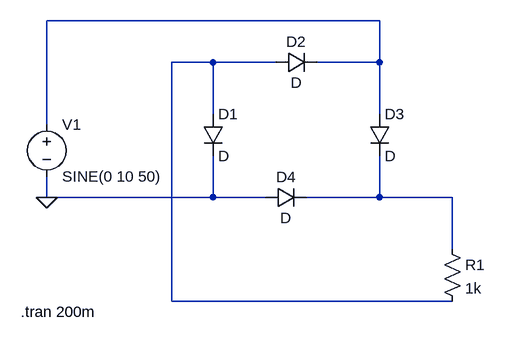
[diagram p0: schematic wave_rectifier.asc]
wave_rectifier.asc, the LTspice schematic file:
Version 4.1
SHEET 1 880 680
WIRE 592 -64 80 -64
WIRE 336 0 272 0
WIRE 432 0 336 0
WIRE 592 0 592 -64
WIRE 592 0 496 0
WIRE 336 80 336 0
WIRE 592 80 592 0
WIRE 80 96 80 -64
WIRE 80 208 80 176
WIRE 336 208 336 144
WIRE 336 208 80 208
WIRE 416 208 336 208
WIRE 592 208 592 144
WIRE 592 208 480 208
WIRE 704 208 592 208
WIRE 704 288 704 208
WIRE 272 368 272 0
WIRE 704 368 272 368
FLAG 80 208 0
SYMBOL voltage 80 80 R0
WINDOW 123 0 0 Left 0
WINDOW 39 0 0 Left 0
SYMATTR InstName V1
SYMATTR Value SINE(0 10 50)
SYMBOL diode 432 16 R270
WINDOW 0 32 32 VTop 2
WINDOW 3 0 32 VBottom 2
SYMATTR InstName D2
SYMBOL diode 576 80 R0
SYMATTR InstName D3
SYMBOL diode 416 224 R270
WINDOW 0 32 32 VTop 2
WINDOW 3 0 32 VBottom 2
SYMATTR InstName D4
SYMBOL diode 320 80 R0
SYMATTR InstName D1
SYMBOL res 688 272 R0
SYMATTR InstName R1
SYMATTR Value 1k
TEXT 40 384 Left 2 !.tran 200m

The netlist it stands for:
* wave_rectifier.asc
V1 N001 0 SINE(0 10 50)
D2 N002 N001 D
D3 N001 N003 D
D4 0 N003 D
D1 N002 0 D
R1 N003 N002 1k
.model D D
.lib standard.dio
.tran 200m
.backanno
.end